# Altium schematic sheet TB906_HW V1.SchDoc
size 513 x 386 mm
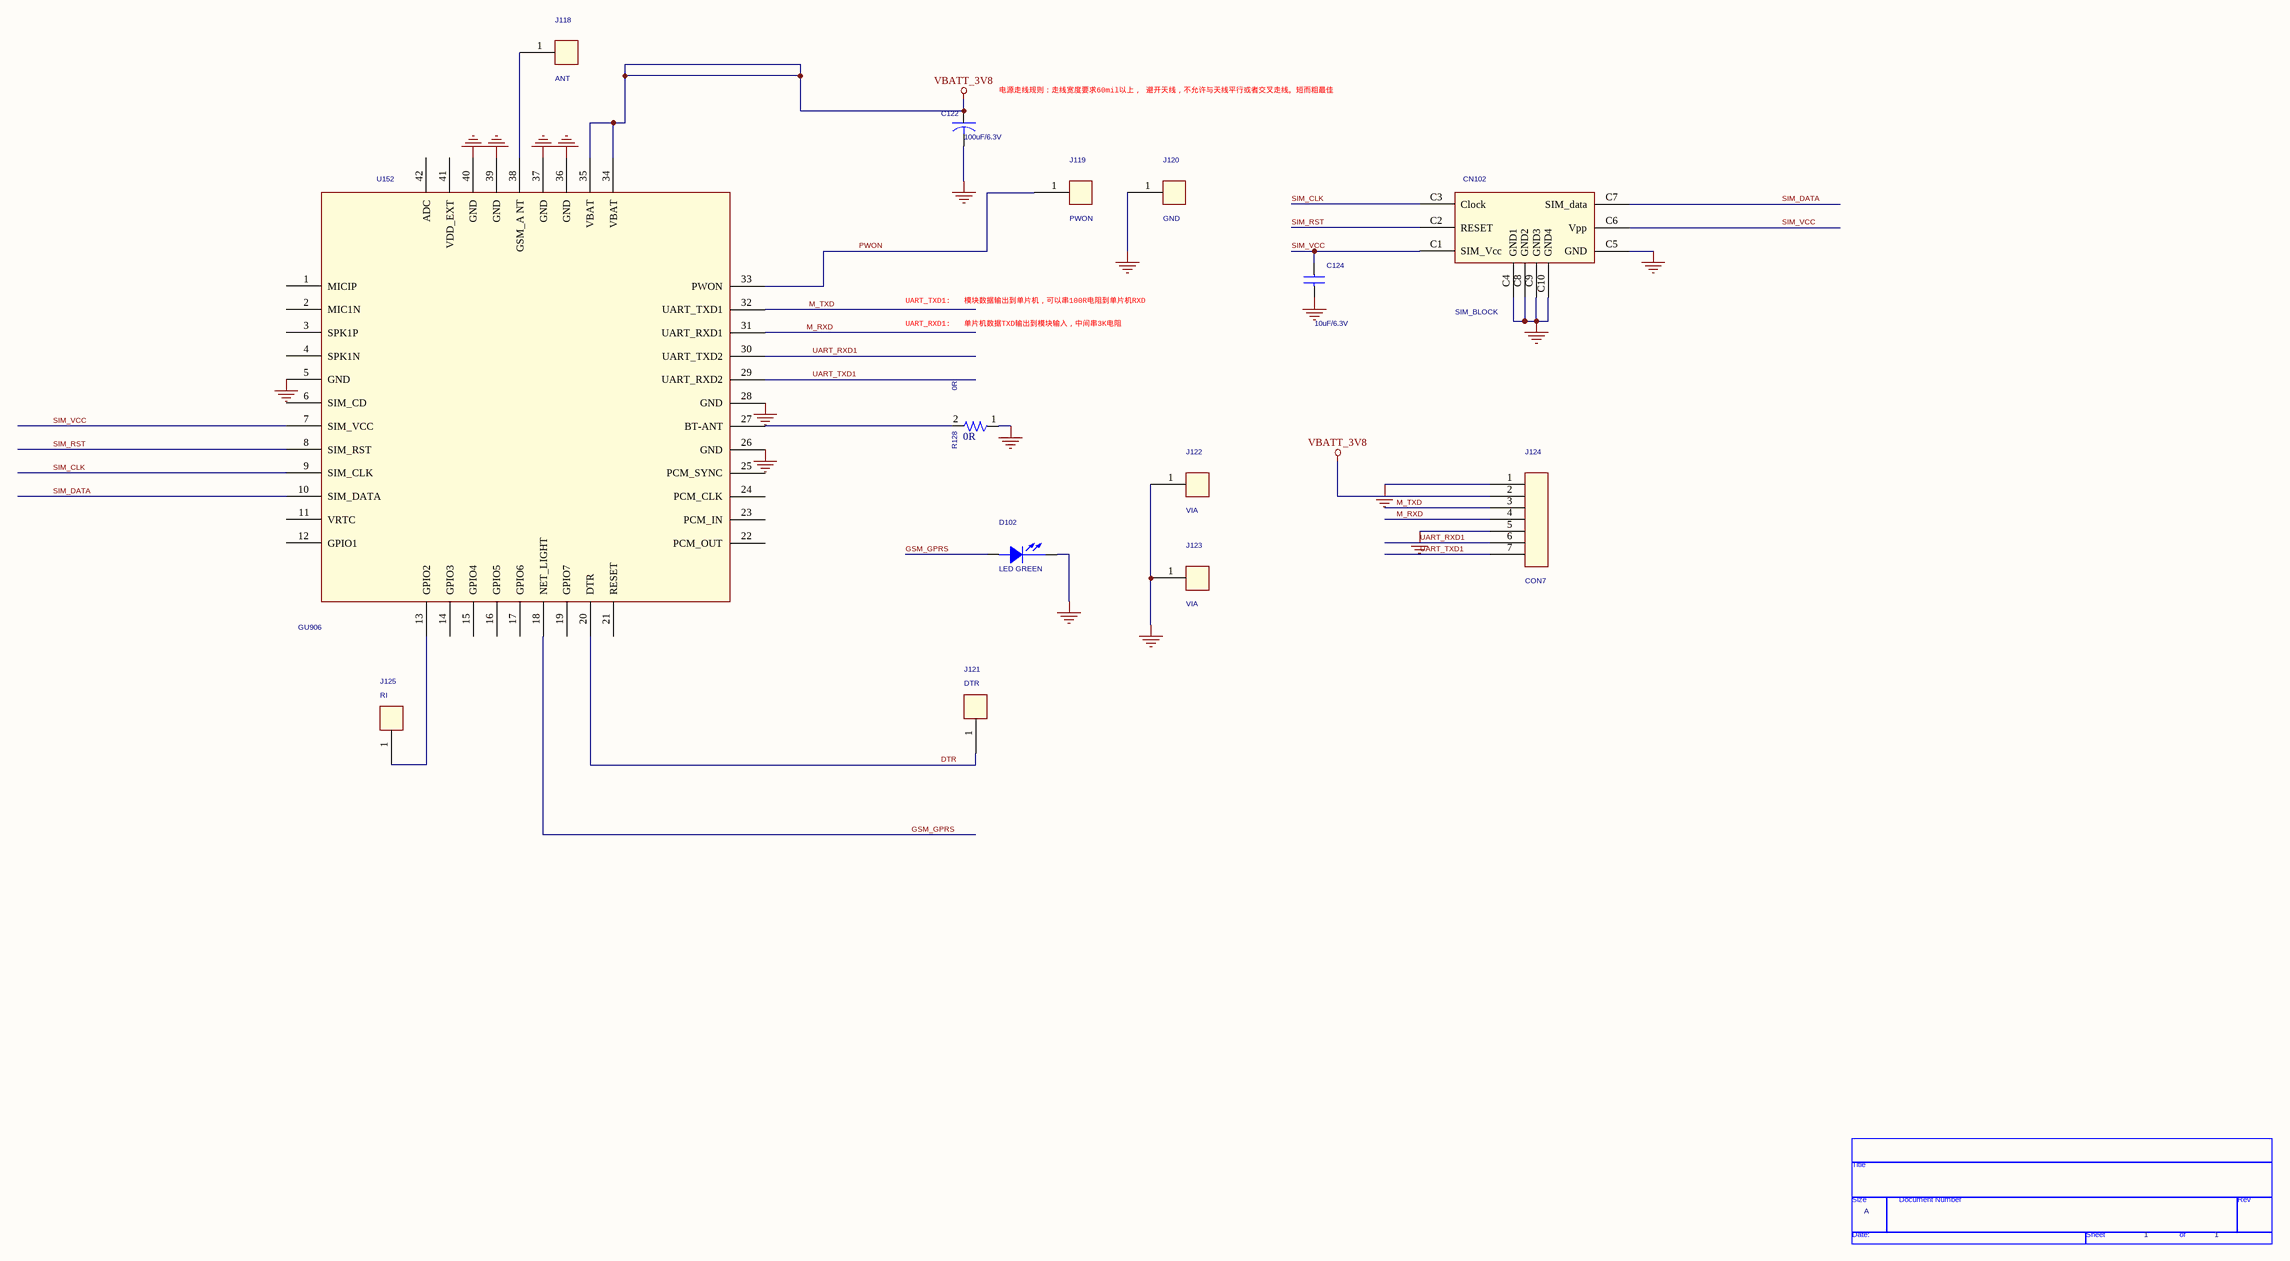
[diagram p0: TB906_HW V1.SchDoc]

## Parts
*  Page Count: 1  Page Size: A  (hidden comment: TitleBlock0)  (graphical)
C122  100uF/6.3V  [1210]
C124  10uF/6.3V  [0603]
CN102  SIM_BLOCK  [SIM_BLOCK]
D102  LED GREEN  [D3.9_LED]
J118  ANT  [TB906_ANT]
J119  PWON  [TP60MIL]
J120  GND  [TP60MIL]
J121  DTR  [TP60MIL]
J122  VIA  [VIA_2.5MM]
J123  VIA  [VIA_2.5MM]
J124  CON7  [SDIP_2.54_7P]
J125  RI  [TP60MIL]
R128  0R  [AX/RC05]
U152  GU906  [HFY_QFN_42_DTU]

## Nets
GND: C122.2 C124.2 CN102.C4(GND1) CN102.C5(GND) CN102.C8(GND2) CN102.C9(GND3) CN102.C10(GND4) D102.2(CATHODE) J120.1 J122.1 J123.1 J124.1 J124.5 R128.1 U152.5(GND) U152.26(GND) U152.28(GND) U152.36(GND) U152.37(GND) U152.39(GND) U152.40(GND)
VBATT_3V8: C122.1 J124.2 U152.34(VBAT) U152.35(VBAT)
DTR: J121.1 U152.20(DTR)
GSM_GPRS: D102.1(ANODE) U152.18(NET_LIGHT)
M_RXD: J124.4 U152.31(UART_RXD1)
M_TXD: J124.3 U152.32(UART_TXD1)
PWON: J119.1 U152.33(PWON)
SIM_CLK: CN102.C3(Clock) U152.9(SIM_CLK)
SIM_DATA: CN102.C7(SIM_data) U152.10(SIM_DATA)
SIM_RST: CN102.C2(RESET) U152.8(SIM_RST)
SIM_VCC: C124.1 CN102.C1(SIM_Vcc) CN102.C6(Vpp) U152.7(SIM_VCC)
UART_RXD1: J124.6 U152.30(UART_TXD2)
UART_TXD1: J124.7 U152.29(UART_RXD2)
NetJ118_1: J118.1 U152.38(GSM_A_NT)
NetJ125_1: J125.1 U152.13(GPIO2)
NetR128_2: R128.2 U152.27(BT-ANT)

Not connected (* = marked no-connect by the designer): U152 1(MICIP) 2(MIC1N) 3(SPK1P) 4(SPK1N) 6(SIM_CD) 11(VRTC) 12(GPIO1) 14(GPIO3) 15(GPIO4) 16(GPIO5) 17(GPIO6) 19(GPIO7) 21(RESET) 22(PCM_OUT) 23(PCM_IN) 24(PCM_CLK) 25(PCM_SYNC) 41(VDD_EXT) 42(ADC)

## Notes on the sheet
- (near C122) 电源走线规则：走线宽度要求60mil以上， 避开天线，不允许与天线平行或者交叉走线。短而粗最佳
- UART_TXD1:   模块数据输出到单片机，可以串100R电阻到单片机RXD
- UART_RXD1:   单片机数据TXD输出到模块输入，中间串3K电阻
- (in symbol TitleBlock0) Title; Size; Document Number; Rev; Date:; Sheet; of

## Library data of the parts
C122 = CAP_5: Pic Spec: C1206
C124 = CAP NP
CN102 = SIM_BLOCK_2
D102 = LED
J118-J123 J125 = CON1
R128 = r: PSpiceTemplate: R^@REFDES %1 %2 ?TOLERANCE|R^@REFDES| @VALUE  ?TOLERANCE|\n.model r^@REFDES RES R=1 DEV=@TOLERANCE%|; Value: 0R
U152 = GU600_LIB_2
* = TitleBlock0: Page Number: 1; Page Create Date: March  8, 1995